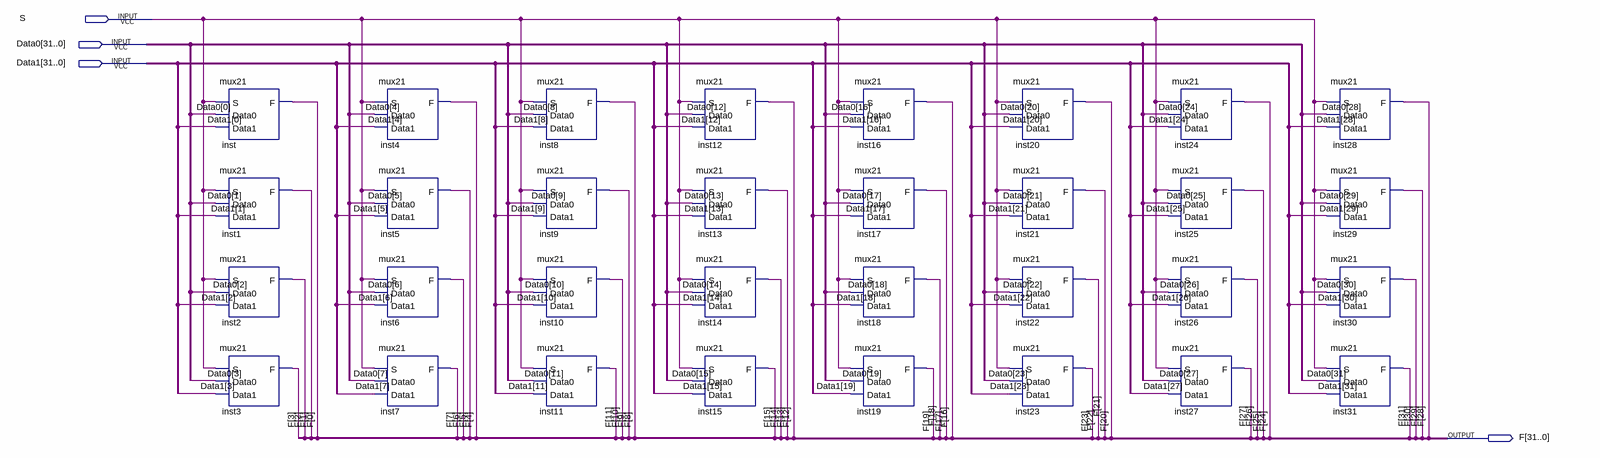
[diagram p0: schematic sheet]
// Quartus schematic mux21_32.bdf as structural Verilog: 32 symbols, 4 pins
module mux21_32 (
  input  S,
  input  [31:0] Data0,
  input  [31:0] Data1,
  output [31:0] F
);

  mux21 inst (.S(S), .Data0(Data0[0]), .Data1(Data1[0]), .F(F[0]));
  mux21 inst1 (.S(S), .Data0(Data0[1]), .Data1(Data1[1]), .F(F[1]));
  mux21 inst2 (.S(S), .Data0(Data0[2]), .Data1(Data1[2]), .F(F[2]));
  mux21 inst3 (.S(S), .Data0(Data0[3]), .Data1(Data1[3]), .F(F[3]));
  mux21 inst4 (.S(S), .Data0(Data0[4]), .Data1(Data1[4]), .F(F[4]));
  mux21 inst5 (.S(S), .Data0(Data0[5]), .Data1(Data1[5]), .F(F[5]));
  mux21 inst6 (.S(S), .Data0(Data0[6]), .Data1(Data1[6]), .F(F[6]));
  mux21 inst7 (.S(S), .Data0(Data0[7]), .Data1(Data1[7]), .F(F[7]));
  mux21 inst8 (.S(S), .Data0(Data0[8]), .Data1(Data1[8]), .F(F[8]));
  mux21 inst9 (.S(S), .Data0(Data0[9]), .Data1(Data1[9]), .F(F[9]));
  mux21 inst10 (.S(S), .Data0(Data0[10]), .Data1(Data1[10]), .F(F[10]));
  mux21 inst11 (.S(S), .Data0(Data0[11]), .Data1(Data1[11]), .F(F[11]));
  mux21 inst12 (.S(S), .Data0(Data0[12]), .Data1(Data1[12]), .F(F[12]));
  mux21 inst13 (.S(S), .Data0(Data0[13]), .Data1(Data1[13]), .F(F[13]));
  mux21 inst14 (.S(S), .Data0(Data0[14]), .Data1(Data1[14]), .F(F[14]));
  mux21 inst15 (.S(S), .Data0(Data0[15]), .Data1(Data1[15]), .F(F[15]));
  mux21 inst16 (.S(S), .Data0(Data0[16]), .Data1(Data1[16]), .F(F[16]));
  mux21 inst17 (.S(S), .Data0(Data0[17]), .Data1(Data1[17]), .F(F[17]));
  mux21 inst18 (.S(S), .Data0(Data0[18]), .Data1(Data1[18]), .F(F[18]));
  mux21 inst19 (.S(S), .Data0(Data0[19]), .Data1(Data1[19]), .F(F[19]));
  mux21 inst20 (.S(S), .Data0(Data0[20]), .Data1(Data1[20]), .F(F[20]));
  mux21 inst21 (.S(S), .Data0(Data0[21]), .Data1(Data1[21]), .F(F[21]));
  mux21 inst22 (.S(S), .Data0(Data0[22]), .Data1(Data1[22]), .F(F[22]));
  mux21 inst23 (.S(S), .Data0(Data0[23]), .Data1(Data1[23]), .F(F[23]));
  mux21 inst24 (.S(S), .Data0(Data0[24]), .Data1(Data1[24]), .F(F[24]));
  mux21 inst25 (.S(S), .Data0(Data0[25]), .Data1(Data1[25]), .F(F[25]));
  mux21 inst26 (.S(S), .Data0(Data0[26]), .Data1(Data1[26]), .F(F[26]));
  mux21 inst27 (.S(S), .Data0(Data0[27]), .Data1(Data1[27]), .F(F[27]));
  mux21 inst28 (.S(S), .Data0(Data0[28]), .Data1(Data1[28]), .F(F[28]));
  mux21 inst29 (.S(S), .Data0(Data0[29]), .Data1(Data1[29]), .F(F[29]));
  mux21 inst30 (.S(S), .Data0(Data0[30]), .Data1(Data1[30]), .F(F[30]));
  mux21 inst31 (.S(S), .Data0(Data0[31]), .Data1(Data1[31]), .F(F[31]));
endmodule
